# Altium schematic sheet TopSheet.SchDoc
size A4; CompanyName: Technische Hochschule Nürnberg Georg Simon Ohm; Organization: UltraZohm; Address1: Kesslerplatz 12; Address2: 90489 Nürnberg; Address3: GERMANY; DocumentNumber: 1; SheetNumber: 1; SheetTotal: 7; Website: www.ultrazohm.com
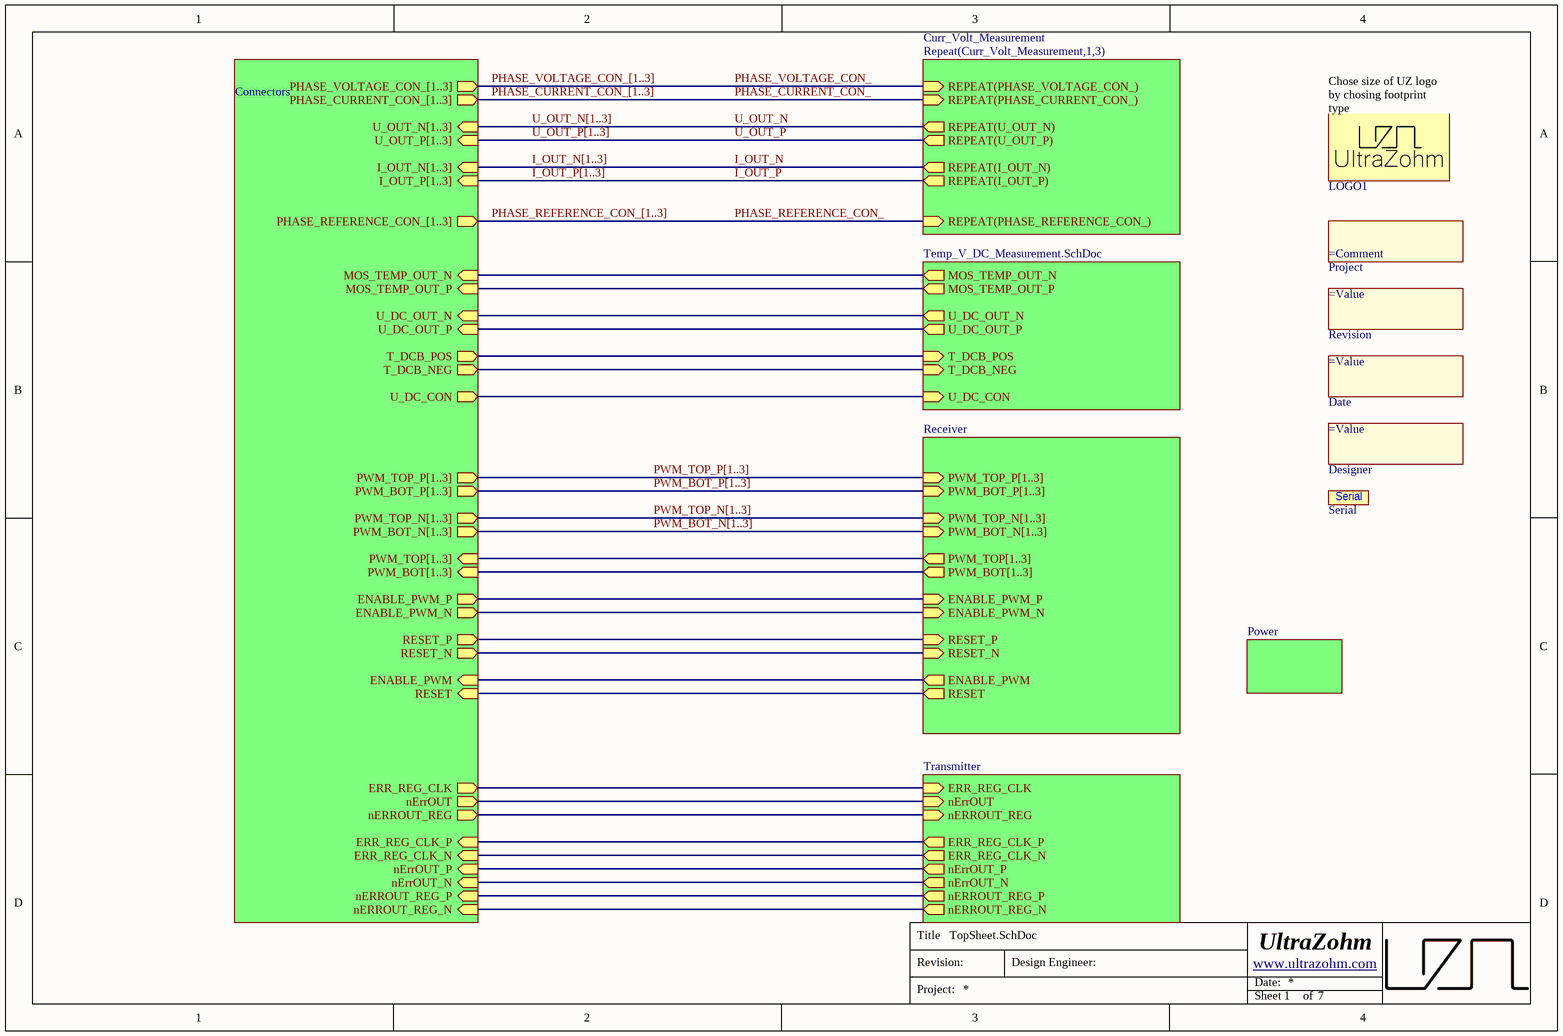
[diagram p0: TopSheet.SchDoc]

## Parts
Date  (no value)  [COMMENT]  (no BOM)
Designer  (no value)  [Designator:comment]  (no BOM)
LOGO1  UZ Logo  [UZ_Logo_small]  (value not drawn)  (no BOM)
Project  (no value)  [COMMENT]  (no BOM)
Revision  (no value)  [Designator:comment]  (no BOM)
Serial  Serial #  [SERIAL]  (value not drawn)

## Sub-sheets
Designator = Transmitter: ERR_REG_CLK (in), nErrOUT (in), nERROUT_REG (in), ERR_REG_CLK_P (out), ERR_REG_CLK_N (out), nErrOUT_P (out), nErrOUT_N (out), nERROUT_REG_P (out), nERROUT_REG_N (out)
Designator = Power: no entries
Repeat(Curr_Volt_Measurement,1,3) = Curr_Volt_Measurement: REPEAT(PHASE_VOLTAGE_CON_) (in), REPEAT(U_OUT_N) (out), REPEAT(U_OUT_P) (out), REPEAT(PHASE_CURRENT_CON_) (in), REPEAT(PHASE_REFERENCE_CON_) (in), REPEAT(I_OUT_N) (out), REPEAT(I_OUT_P) (out)
? = Temp_V_DC_Measurement.SchDoc: MOS_TEMP_OUT_N (out), MOS_TEMP_OUT_P (out), U_DC_OUT_N (out), U_DC_OUT_P (out), T_DCB_POS (in), T_DCB_NEG (in), U_DC_CON (in)
? = Connectors: PHASE_REFERENCE_CON_[1..3] (out), U_OUT_P[1..3] (in), U_OUT_N[1..3] (in), PHASE_CURRENT_CON_[1..3] (out), PHASE_VOLTAGE_CON_[1..3] (out), U_DC_OUT_P (in), U_DC_OUT_N (in), MOS_TEMP_OUT_P (in), MOS_TEMP_OUT_N (in), PWM_TOP_P[1..3] (out), PWM_BOT_P[1..3] (out), PWM_TOP_N[1..3] (out), PWM_BOT_N[1..3] (out), ENABLE_PWM_P (out), ENABLE_PWM_N (out), RESET_P (out), RESET_N (out), ENABLE_PWM (in), RESET (in), ERR_REG_CLK (out), nErrOUT (out), nERROUT_REG (out), ERR_REG_CLK_P (in), ERR_REG_CLK_N (in), nErrOUT_P (in), nErrOUT_N (in), nERROUT_REG_P (in), nERROUT_REG_N (in), T_DCB_POS (out), T_DCB_NEG (out), U_DC_CON (out), PWM_BOT[1..3] (in), PWM_TOP[1..3] (in), I_OUT_N[1..3] (in), I_OUT_P[1..3] (in)
? = Receiver: PWM_TOP_P[1..3] (in), PWM_BOT_P[1..3] (in), PWM_TOP_N[1..3] (in), PWM_BOT_N[1..3] (in), ENABLE_PWM_P (in), ENABLE_PWM_N (in), RESET_P (in), RESET_N (in), ENABLE_PWM (out), RESET (out), PWM_BOT[1..3] (out), PWM_TOP[1..3] (out)

## Nets
I_OUT_N: sheet Repeat(Curr_Volt_Measurement,1,3)/REPEAT(I_OUT_N)
I_OUT_P: sheet Repeat(Curr_Volt_Measurement,1,3)/REPEAT(I_OUT_P)
PHASE_CURRENT_CON_: sheet Repeat(Curr_Volt_Measurement,1,3)/REPEAT(PHASE_CURRENT_CON_)
PHASE_REFERENCE_CON_: sheet Repeat(Curr_Volt_Measurement,1,3)/REPEAT(PHASE_REFERENCE_CON_)
PHASE_VOLTAGE_CON_: sheet Repeat(Curr_Volt_Measurement,1,3)/REPEAT(PHASE_VOLTAGE_CON_)
U_OUT_N: sheet Repeat(Curr_Volt_Measurement,1,3)/REPEAT(U_OUT_N)
U_OUT_P: sheet Repeat(Curr_Volt_Measurement,1,3)/REPEAT(U_OUT_P)
(unnamed): sheet /MOS_TEMP_OUT_N, sheet /MOS_TEMP_OUT_N
(unnamed): sheet /MOS_TEMP_OUT_P, sheet /MOS_TEMP_OUT_P
(unnamed): sheet /U_DC_OUT_N, sheet /U_DC_OUT_N
(unnamed): sheet /U_DC_OUT_P, sheet /U_DC_OUT_P
(unnamed): sheet /T_DCB_POS, sheet /T_DCB_POS
(unnamed): sheet /T_DCB_NEG, sheet /T_DCB_NEG
(unnamed): sheet /U_DC_CON, sheet /U_DC_CON
(unnamed): sheet /ENABLE_PWM_P, sheet /ENABLE_PWM_P
(unnamed): sheet /ENABLE_PWM_N, sheet /ENABLE_PWM_N
(unnamed): sheet /RESET_P, sheet /RESET_P
(unnamed): sheet /RESET_N, sheet /RESET_N
(unnamed): sheet /ENABLE_PWM, sheet /ENABLE_PWM
(unnamed): sheet /RESET, sheet /RESET
(unnamed): sheet /ERR_REG_CLK, sheet Designator/ERR_REG_CLK
(unnamed): sheet /nErrOUT, sheet Designator/nErrOUT
(unnamed): sheet /nERROUT_REG, sheet Designator/nERROUT_REG
(unnamed): sheet /ERR_REG_CLK_P, sheet Designator/ERR_REG_CLK_P
(unnamed): sheet /ERR_REG_CLK_N, sheet Designator/ERR_REG_CLK_N
(unnamed): sheet /nErrOUT_P, sheet Designator/nErrOUT_P
(unnamed): sheet /nErrOUT_N, sheet Designator/nErrOUT_N
(unnamed): sheet /nERROUT_REG_P, sheet Designator/nERROUT_REG_P
(unnamed): sheet /nERROUT_REG_N, sheet Designator/nERROUT_REG_N

## Buses and harness runs
bus I_OUT_N[1..3] = sheet /I_OUT_N[1..3]
bus I_OUT_P[1..3] = sheet /I_OUT_P[1..3]
bus PHASE_CURRENT_CON_[1..3] = sheet /PHASE_CURRENT_CON_[1..3]
bus PHASE_REFERENCE_CON_[1..3] = sheet /PHASE_REFERENCE_CON_[1..3]
bus PHASE_VOLTAGE_CON_[1..3] = sheet /PHASE_VOLTAGE_CON_[1..3]
bus PWM_BOT_N[1..3] = sheet /PWM_BOT_N[1..3]
bus PWM_BOT_P[1..3] = sheet /PWM_BOT_P[1..3]
bus PWM_TOP_N[1..3] = sheet /PWM_TOP_N[1..3]
bus PWM_TOP_P[1..3] = sheet /PWM_TOP_P[1..3]
bus U_OUT_N[1..3] = sheet /U_OUT_N[1..3]
bus U_OUT_P[1..3] = sheet /U_OUT_P[1..3]

## Notes on the sheet
- (near LOGO1) Chose size of UZ logo by chosing footprint type
- Title
- Revision:
- Design Engineer:
- Date:
- Project:
- Sheet
- of

## Library data of the parts
Date = 5: Create a project parameter named "FinDate" this is the value of this component. It is printed on the PCB. Once the parameter is updated (e.g. new revision) it gets updated on the PCB as well; Manufacturer: PCB Manufacturer; Manufacturer Part Number: Project End Date; Created from: T. Wendt; PartID: 5; Created On: 01.03.2021 09:01:41; Component Type: Date of Project Finalization; Last Updated: 01.03.2021 09:01:41; Type: Standard (No BOM); Value: =FinDate; Live Cycle Status: 1
Designer = 4: Create a project parameter named "Author" this is the value of this component. It is printed on the PCB. Once the parameter is updated (e.g. new revision) it gets updated on the PCB as well; Manufacturer: PCB Manufacturer; Manufacturer Part Number: Project Author; Created from: T. Wendt; PartID: 4; Created On: 01.03.2021 08:53:41; Component Type: Project Author; Last Updated: 01.03.2021 09:20:27; Type: Standard (No BOM); Value: =AuthorParam; Live Cycle Status: 1
LOGO1 = 1: Official Project Logo of the UltraZohm; Manufacturer: PCB Manufacturer; Manufacturer Part Number: UltraZohm Logo; Created from: T. Wendt; PartID: 1; Created On: 19.02.2021 16:55:56; ComponentLink1Description: Homepage; ComponentLink1URL: https://ultrazohm.com; Component Type: Logo; Last Updated: 02.03.2021 14:31:24; Type: Standard (No BOM); Live Cycle Status: 1
Project = 2: Create a project parameter named "ProjectNameCustom" this is the value of this component and it is printed on the PCB.; Manufacturer: PCB Manufacturer; Created from: T. Wendt; PartID: 2; Created On: 01.03.2021 08:43:57; Component Type: Project Name; Last Updated: 01.03.2021 09:07:27; Manufacturer Part Number: Project Name; Type: Standard (No BOM); Value: =ProjectNameCustom; Live Cycle Status: 1
Revision = 3: Create a project parameter named "ProjectRevision" this is the value of this component. It is printed on the PCB. Once the parameter is updated (e.g. new revision) it gets updated on the PCB as well; Manufacturer: PCB Manufacturer; Created from: T. Wendt; PartID: 3; Created On: 01.03.2021 08:50:34; Component Type: Project Revision; Last Updated: 01.03.2021 09:28:36; Manufacturer Part Number: Project Revision; Type: Standard (No BOM); Value: =ProjectRevision; Live Cycle Status: 1
Serial = 6: Field to put in a serial number; Manufacturer: PCB Manufacturer; Created from: T. Wendt; PartID: 6; Created On: 02.03.2021 14:31:24; Component Type: Serial Number; Last Updated: 02.03.2021 14:31:24; Manufacturer Part Number: Serial Number; Type: Standard (No BOM); Live Cycle Status: 1